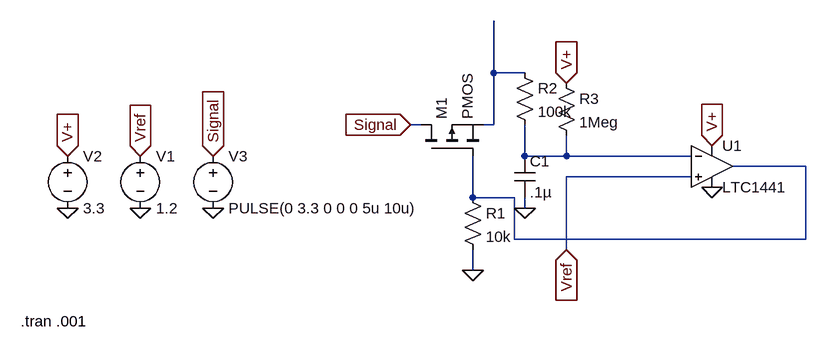
[diagram p0: schematic I2Cprotection.asc]
I2Cprotection.asc, the LTspice schematic file:
Version 4
SHEET 1 880 680
WIRE 16 64 16 -16
WIRE 64 64 16 64
WIRE -96 144 -112 144
WIRE 16 144 16 64
WIRE 16 144 0 144
WIRE 64 192 64 144
WIRE 128 192 128 160
WIRE 128 192 64 192
WIRE 320 192 128 192
WIRE 496 208 384 208
WIRE 320 224 128 224
WIRE -16 256 -16 192
WIRE 48 256 -16 256
WIRE 64 272 64 256
WIRE 48 320 48 256
WIRE 496 320 496 208
WIRE 496 320 48 320
WIRE 128 336 128 224
WIRE -16 368 -16 336
FLAG -16 368 0
FLAG 128 336 Vref
IOPIN 128 336 In
FLAG 64 272 0
FLAG -528 272 0
FLAG -528 192 Vref
IOPIN -528 192 In
FLAG -640 272 0
FLAG -640 192 V+
IOPIN -640 192 In
FLAG 352 176 V+
IOPIN 352 176 In
FLAG 352 240 0
FLAG -416 192 Signal
IOPIN -416 192 In
FLAG -416 272 0
FLAG -112 144 Signal
IOPIN -112 144 In
FLAG 128 80 V+
IOPIN 128 80 In
SYMBOL Comparators\\LTC1441 352 144 R0
SYMATTR InstName U1
SYMBOL voltage -528 176 R0
WINDOW 123 0 0 Left 0
WINDOW 39 0 0 Left 0
SYMATTR InstName V1
SYMATTR Value 1.2
SYMBOL pmos -96 192 R270
SYMATTR InstName M1
SYMBOL res -32 240 R0
SYMATTR InstName R1
SYMATTR Value 10k
SYMBOL cap 48 192 R0
SYMATTR InstName C1
SYMATTR Value .1µ
SYMBOL voltage -640 176 R0
WINDOW 123 0 0 Left 0
WINDOW 39 0 0 Left 0
SYMATTR InstName V2
SYMATTR Value 3.3
SYMBOL voltage -416 176 R0
WINDOW 123 0 0 Left 0
WINDOW 39 0 0 Left 0
SYMATTR InstName V3
SYMATTR Value PULSE(0 3.3 0 0 0 5u 10u)
SYMBOL res 48 48 R0
SYMATTR InstName R2
SYMATTR Value 100k
SYMBOL res 112 64 R0
SYMATTR InstName R3
SYMATTR Value 1Meg
TEXT -712 446 Left 2 !.tran .001

The netlist it stands for:
* I2Cprotection.asc
XU1 Vref N002 V+ 0 N003 LTC1441  ; pins In+ In- V+ V- OUT
V1 Vref 0 1.2
M1 Signal N003 N001 N001 PMOS
R1 N003 0 10k
C1 N002 0 .1µ
V2 V+ 0 3.3
V3 Signal 0 PULSE(0 3.3 0 0 0 5u 10u)
R2 N001 N002 100k
R3 V+ N002 1Meg
.model NMOS NMOS
.model PMOS PMOS
.lib standard.mos
.tran .001
.backanno
.end